# EAGLE design Top_Bar (EAGLE 9.1.1)
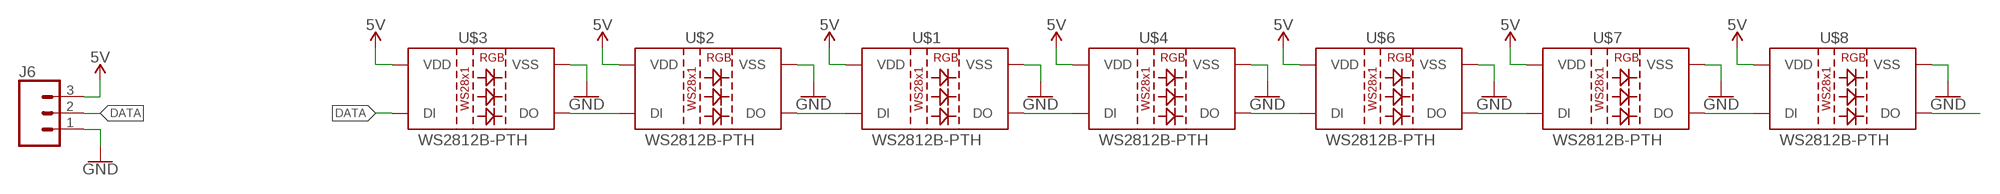
[diagram p0: schematic, sheet 1]

## Parts
J6  CONN_03  [1X03]
U$1  WS2812B-PTH  [WS2812B-PTH-KIT]
U$2  WS2812B-PTH  [WS2812B-PTH-KIT]
U$3  WS2812B-PTH  [WS2812B-PTH-KIT]
U$4  WS2812B-PTH  [WS2812B-PTH-KIT]
U$6  WS2812B-PTH  [WS2812B-PTH-KIT]
U$7  WS2812B-PTH  [WS2812B-PTH-KIT]
U$8  WS2812B-PTH  [WS2812B-PTH-KIT]

## Nets
5V: J6.3 U$1.2(VDD) U$2.2(VDD) U$3.2(VDD) U$4.2(VDD) U$6.2(VDD) U$7.2(VDD) U$8.2(VDD)
DATA: J6.2 U$3.1(DI)
GND: J6.1 U$1.3(VSS) U$2.3(VSS) U$3.3(VSS) U$4.3(VSS) U$6.3(VSS) U$7.3(VSS) U$8.3(VSS)
N$1: U$1.4(DO) U$4.1(DI)
N$3: U$4.4(DO) U$6.1(DI)
N$4: U$6.4(DO) U$7.1(DI)
N$5: U$7.4(DO) U$8.1(DI)
N$6: U$8.4(DO)
N$7: U$2.1(DI) U$3.4(DO)
N$8: U$1.1(DI) U$2.4(DO)

## Library data of the parts
J6 = SparkFun-Connectors:CONN_03: Multi connection point. Often used as Generic Header-pin footprint for 0.1 inch spaced/style header connections On any of the 0.1 inch spaced packages, you can populate with these: Break Away Headers - Straight <https://www.sparkfun.com/products/116> (PRT-00116) Break Away Male Headers - Right Angle <https://www.sparkfun.com/products/553> (PRT-00553) Female Headers <https://www.sparkfun.com/products/115> (PRT-00115) Break Away Headers - Machine Pin <https://www.sparkfun.com/products/117> (PRT-00117) Break Away Female Headers - Swiss Machine Pin <https://www.sparkfun.com/products/743> (PRT-00743) Stackable Header - 3 Pin (Female, 0.1") <https://www.sparkfun.com/products/13875> (PRT-13875) For SCREWTERMINALS and SPRING TERMINALS visit here: Screw Terimnals on SparkFun.com <https://www.sparkfun.com/search/results?term=Screw+Terminals> (5mm/3.5mm/2.54mm spacing) This device is also useful as a general connection point to wire up your design to another part of your project. Our various solder wires solder well into these plated through hole pads. Hook-Up Wire - Assortment (Stranded, 22 AWG) <https://www.sparkfun.com/products/11375> (PRT-11375) Hook-Up Wire - Assortment (Solid Core, 22 AWG) <https://www.sparkfun.com/products/11367> (PRT-11367) View the entire wire category on our website here <https://www.sparkfun.com/categories/141> Special notes: Molex polarized connector foot print use with SKU : PRT-08232 with associated crimp pins and housings.; PROD_ID: XXX-00000; VALUE: 455-1750-1-ND
U$1-U$4 U$6-U$8 = SparkFun-LED:WS2812B-PTH: WS2812B PTH addressable RGB LED 5mm PTH LED with built-in controller IC. Color: Red/Green/Blue mC Rating: RGB: 390, 660, 180 mcd Forward Voltage: RGB: 2.0, 3.0, 3.0 V SparkFun Products: LED - RGB Addressable, PTH, 5mm Diffused (5 Pack) <https://www.sparkfun.com/products/12986> LED - RGB Addressable, PTH, 5mm Clear (5 Pack) <https://www.sparkfun.com/products/12999> Datasheet referenced for footprint: WS2812B-PTH <https://cdn.sparkfun.com/datasheets/Components/LED/COM-12877.pdf>

## Board
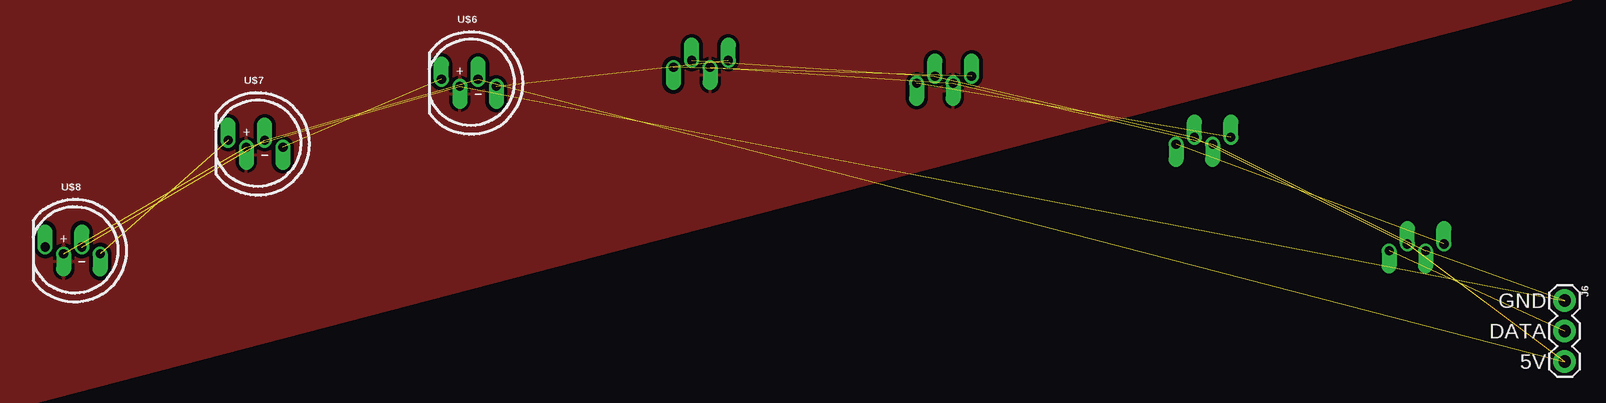
[diagram p1: board, top side]
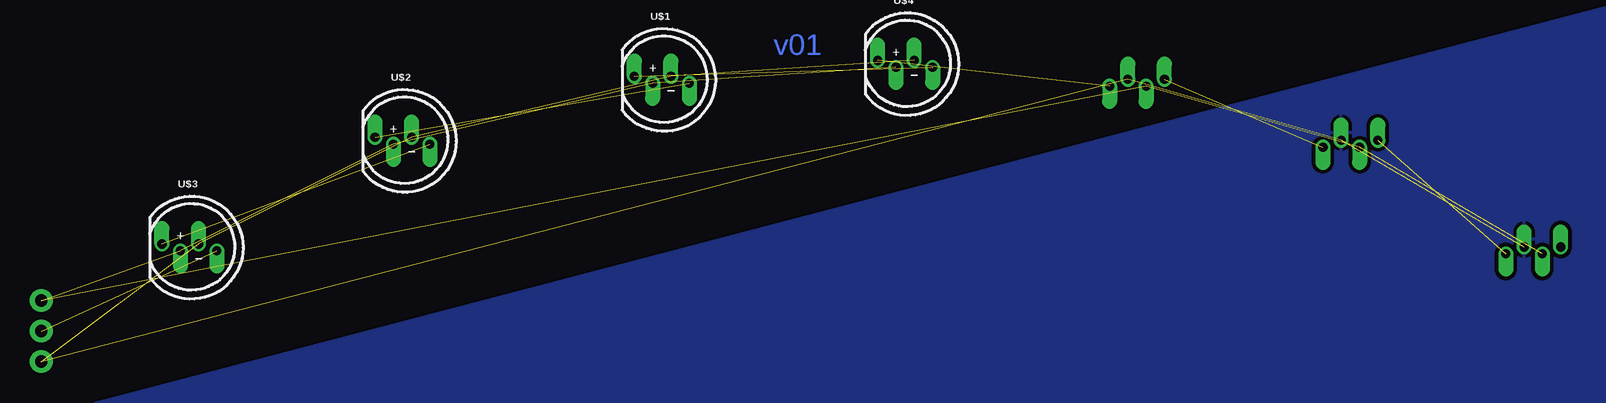
[diagram p2: board, bottom side, seen from below]

No outline drawn. Coordinates in mm, seen from the top.
Copper layers (1*16): Top 0.035mm / dielectric 1.5mm / Bottom 0.035mm
Design rules "SparkFun-2-layer-STANDARD": minimum track width 10mil, minimum drill 20mil, track to track 10mil, track to pad 8mil, pad to pad 8mil, via to via 10mil, smd to smd 8mil, copper to edge 8mil, drill to drill 8mil, minimum pad ring 10mil, minimum via ring 10mil, stop-mask expansion 4mil, vias tented up to drill 25mil, thermal gap 10mil

### Footprints (pad centres in the part's own frame; a part is rotated, then mirrored left to right if it is on the bottom)
1X03 = drill 1.016 pad 1.88: 1 0,0; 2 2.54,0; 3 5.08,0
WS2812B-PTH-KIT = drill 0.762 pad 1.27 offset: 1 2.413,0.079; 2 0.889,0.651; 3 -0.635,0.079; 4 -2.159,0.651

### Placement (x,y rotation side)
J6  144.78,73.66 270 top
U$1  93.19,91.69 0 bottom
U$2  114.81,86.61 0 bottom
U$3  132.56,77.72 0 bottom
U$4  72.92,93.01 0 bottom
U$5  [GLASSES]  72.39,86.36 0 top
U$6  53.34,91.44 0 top
U$7  35.56,86.36 0 top
U$8  20.32,77.47 0 top
U$9  [SIDE_REF]  156.21,-10.16 10 top
U$10  [SIDE_REF]  -3.81,-7.62 10 bottom

### Tracks (layer width: path | path; a pad name or v marks a point on that pad's centre or on a via)
5V  (7 unrouted)
  pour Bottom (isolate 0.305): 156.21,60.96 1.27,60.96 1.27,101.6
DATA  (1 unrouted)
GND  (7 unrouted)
  pour Top (isolate 0.305): 156.21,101.6 1.27,101.6 1.27,60.96
N$1  (1 unrouted)
N$3  (1 unrouted)
N$4  (1 unrouted)
N$5  (1 unrouted)
N$7  (1 unrouted)
N$8  (1 unrouted)

### Text on the board
Bottom: v01
tPlace: GND | DATA | 5V